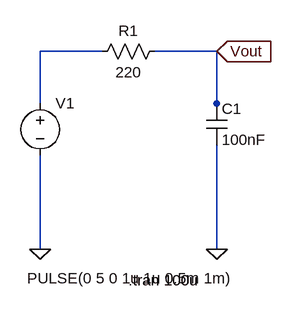
[diagram p0: schematic Lab_7_First Order RC.asc]
Lab_7_First Order RC.asc, the LTspice schematic file:
Version 4
SHEET 1 880 680
WIRE 208 192 112 192
WIRE 384 192 288 192
WIRE 112 272 112 192
WIRE 384 272 384 192
WIRE 384 288 384 272
WIRE 112 496 112 352
WIRE 384 496 384 336
FLAG 384 496 0
FLAG 112 496 0
FLAG 384 192 Vout
IOPIN 384 192 In
SYMBOL Voltage 112 256 R0
WINDOW 3 -20 285 Left 2
SYMATTR Value PULSE(0 5 0 1u 1u 0.5m 1m)
SYMATTR InstName V1
SYMBOL Res 304 176 R90
WINDOW 0 0 56 VBottom 2
WINDOW 3 32 56 VTop 2
SYMATTR InstName R1
SYMATTR Value 220
SYMBOL Cap 368 272 R0
SYMATTR InstName C1
SYMATTR Value 100nF
TEXT 248 544 Left 2 !.tran 100u

The netlist it stands for:
* Lab_7_First Order RC.asc
V1 N001 0 PULSE(0 5 0 1u 1u 0.5m 1m)
R1 Vout N001 220
C1 Vout 0 100nF
.tran 100u
.backanno
.end